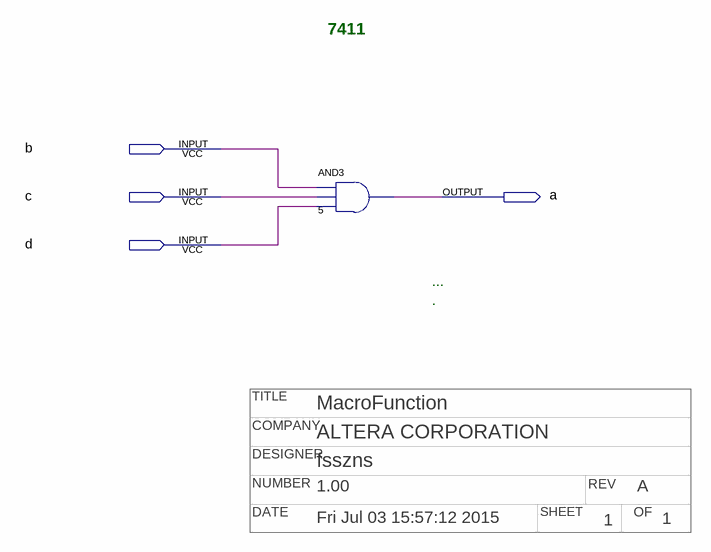
[diagram p0: schematic sheet]
// Quartus schematic a7411.bdf as structural Verilog: 1 symbols, 4 pins
// Title block: TITLE: MacroFunction; COMPANY: ALTERA CORPORATION; DESIGNER: fsszns; NUMBER: 1.00; REV: A; DATE: Fri Jul 03 15:57:12 2015; SHEET: 1; OF: 1
module a7411 (
  input  b,
  input  c,
  input  d,
  output a
);

  and u_5 (a, b, c, d);

  // Notes on the sheet:
  //   7411
  //   ...
  //   .
endmodule
